# Altium schematic sheet BMS_TEMP.SchDoc
size B; Organization: Altium Limited; Address1: L3, 12a Rodborough Rd; Address2: Frenchs Forest; Address3: NSW; Address4: Australia 2086
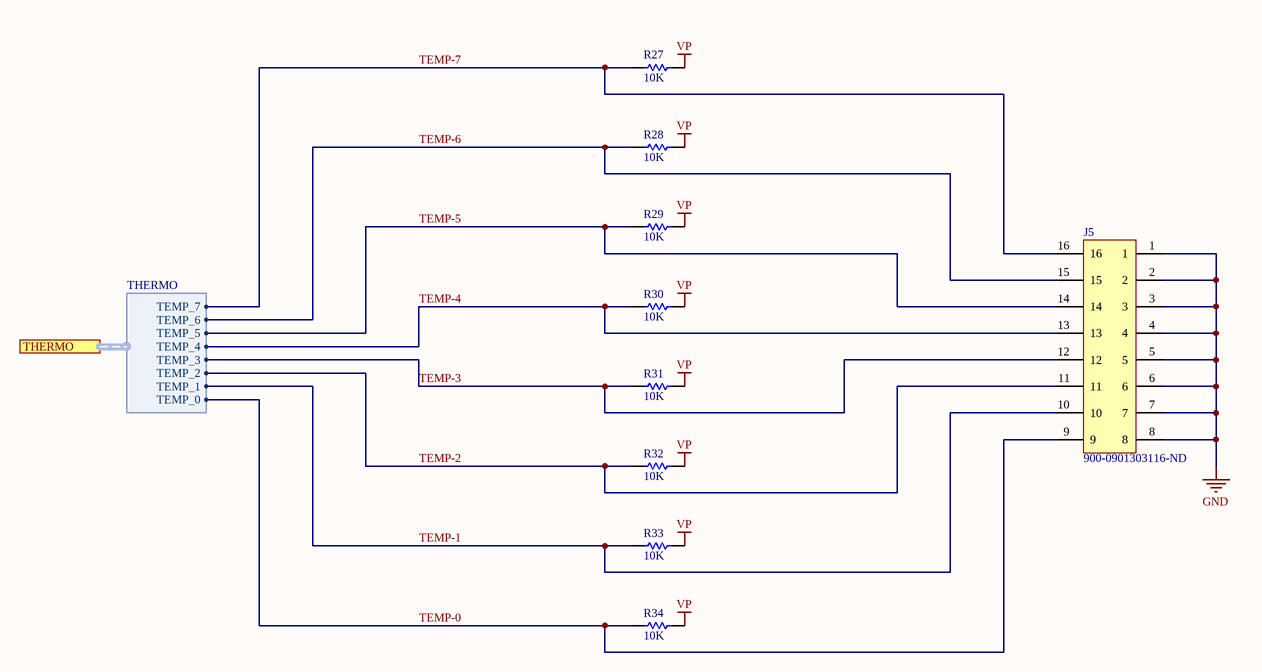
[diagram p0: BMS_TEMP.SchDoc]

## Parts
J5  900-0901303116-ND  [2X8PIN]
R27  10K  [RES-0603]
R28  10K  [RES-0603]
R29  10K  [RES-0603]
R30  10K  [RES-0603]
R31  10K  [RES-0603]
R32  10K  [RES-0603]
R33  10K  [RES-0603]
R34  10K  [RES-0603]

## Ports
THERMO (harness THERMO)

## Harnesses
THERMO: TEMP_0, TEMP_1, TEMP_2, TEMP_3, TEMP_4, TEMP_5, TEMP_6, TEMP_7

## Nets
GND: J5.1 J5.2 J5.3 J5.4 J5.5 J5.6 J5.7 J5.8
VP: R27.1 R28.1 R29.1 R30.1 R31.1 R32.1 R33.1 R34.1
TEMP-0: J5.9 R34.2 ; port THERMO.TEMP_0
TEMP-1: J5.10 R33.2 ; port THERMO.TEMP_1
TEMP-2: J5.11 R32.2 ; port THERMO.TEMP_2
TEMP-3: J5.12 R31.2 ; port THERMO.TEMP_3
TEMP-4: J5.13 R30.2 ; port THERMO.TEMP_4
TEMP-5: J5.14 R29.2 ; port THERMO.TEMP_5
TEMP-6: J5.15 R28.2 ; port THERMO.TEMP_6
TEMP-7: J5.16 R27.2 ; port THERMO.TEMP_7

## Notes on the sheet
- Title
- Size:
- Date:
- Tabloid
- Number:
- Time:
- Revision:
- Sheet
- of
- File:

## Library data of the parts
J5 = 2X8PIN: CONN HEADER R/A 16POS 2.54MM; Manufacturer: Molex; Manufacturer Part Number: 90130-3116; Max Voltage Rating (DC): 350.35kV; Number of Contacts: 16; Current Rating: 3A; Voltage Rating: 350V; Gender: Male; Connector Type: Male Pin; Row Spacing: 0.1inch; Glow Wire Compliant: Non-compliant; Supplier 1: Digi-Key; Stock 1: 1915; Pricing 1: 1=1.82, 10=1.654, 100=1.4181, 500=1.18178, 1000=1.01295, 5000=0.89815, 10000=0.87789 (USD); Mount: Through Hole; Contact Material: Brass; Contact Plating: Tin,Lead; Housing Color: Black; Housing Material: Polyester; Color: Black; Min Operating Temperature: -55°C; Max Operating Temperature: 125°C; Packaging: Tray; Number of Rows: 2; Termination: Solder; Orientation: Right Angle; Package Quantity: 1; Voltage Rating (AC): 350V; Number of Positions: 16; Voltage Rating (DC): 350V; Number of Circuits: 16; Pitch: 2.54mm; Contact Mating Length: 0.266inch; Radiation Hardening: No; Lead Free: Lead Free; ComponentLink1URL: https://www.molex.com/pdm_docs/sd/901303116_sd.pdf?src-supplier=Digi-Key; ComponentLink1Description: https://www.molex.com/pdm_docs/sd/901303116_sd.pdf?src-supplier=Digi-Key; ComponentLink2URL: http://uk.rs-online.com/webdocs/13c4/0900766b813c4c91.pdf?src-supplier=RSComponents; ComponentLink2Description: http://uk.rs-online.com/webdocs/13c4/0900766b813c4c91.pdf?src-supplier=RSComponents; ComponentLink3URL: http://www.molex.com/webdocs/datasheets/pdf/en-us/0901303116_PCB_HEADERS.pdf?src-supplier=Avnet+Europe; ComponentLink3Description: http://www.molex.com/webdocs/datasheets/pdf/en-us/0901303116_PCB_HEADERS.pdf?src-supplier=Avnet+Europe; ComponentLink4URL: http://www.mouser.com/ds/2/276/0901303116_PCB_HEADERS-151568.pdf?src-supplier=Mouser; ComponentLink4Description: http://www.mouser.com/ds/2/276/0901303116_PCB_HEADERS-151568.pdf?src-supplier=Mouser; ComponentLink5URL: http://www.molex.com/webdocs/datasheets/pdf/en-us/0901303116_PCB_HEADERS.pdf?src-supplier=Avnet; ComponentLink5Description: http://www.molex.com/webdocs/datasheets/pdf/en-us/0901303116_PCB_HEADERS.pdf?src-supplier=Avnet; ComponentLink6URL: http://www.onlinecomponents.com/productFiles/mf-MOL/88590901303116_pcb_headers.pdf?src-supplier=Onlinecomponents.com; ComponentLink6Description: http://www.onlinecomponents.com/productFiles/mf-MOL/88590901303116_pcb_headers.pdf?src-supplier=Onlinecomponents.com; Supplier Part Number 1: 900-0901303116-ND
R27-R34 = 0603-10KR: RES SMD 10K OHM 5% 1/10W 0603; Manufacturer: Yageo; Manufacturer Part Number: RC0603JR-0710KL; Resistance: 10kR; Voltage Rating (DC): 50V; Temperature Coefficient: 100ppm/°C; Power Rating: 100mW; Supplier 1: Digi-Key; Stock 1: 3006558; Pricing 1: 1=0.1, 10=0.019, 100=0.0077, 1000=0.00347, 2500=0.00301 (USD); Case/Package: 0603; Number of Pins: 2; Contact Plating: Tin,Matte; Case Code (Imperial): 0603; Case Code (Metric): 1608; Min Operating Temperature: -55°C; Max Operating Temperature: 155°C; Packaging: Tape and Reel; Tolerance: 5%; Composition: Thick Film; Voltage Rating: 50V; Termination: SMD/SMT; Military Standard: Not; Features: Moisture Resistant; Max Power Dissipation: 100mW; Number of Terminations: 2; Length: 0.063inch; Width: 0.031inch; Depth: 0.8mm; Height - Seated (Max): 0.022inch; Radiation Hardening: No; REACH SVHC: Unknown; Lead Free: Lead Free; ComponentLink1URL: http://www.yageo.com/documents/recent/PYu-RC_Group_51_RoHS_L_10.pdf?src-supplier=Digi-Key; ComponentLink1Description: http://www.yageo.com/documents/recent/PYu-RC_Group_51_RoHS_L_10.pdf?src-supplier=Digi-Key; Supplier Part Number 1: 311-10KGRDKR-ND